# Altium schematic sheet stoplight_v1.0.SchDoc
size A4
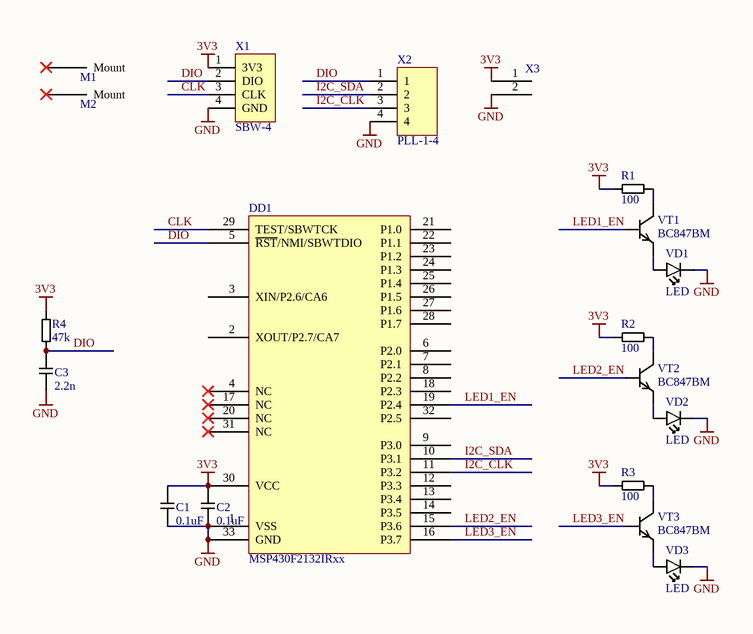
[diagram p0: stoplight_v1.0.SchDoc]

## Parts
C1  0.1uF  [C0603]
C2  0.1uF  [C0603]
C3  2.2n  [C0603]
DD1  MSP430F2132IRxx  [QFN-32 5x5 0.5]
M1  MountHoleEmpty  [MountHole 2mm Empty]  (value not drawn)
M2  MountHoleEmpty  [MountHole 2mm Empty]  (value not drawn)
R1  100  [R0603]
R2  100  [R0603]
R3  100  [R0603]
R4  47k  [R0603]
VD1  LED  [LED0603]
VD2  LED  [LED0603]
VD3  LED  [LED0603]
VT1  BC847BM  [SOT-883]
VT2  BC847BM  [SOT-883]
VT3  BC847BM  [SOT-883]
X1  SBW-4  [PLL-1-4]
X2  PLL-1-4  [PLL-1-4]
X3  POWER_PINS  [POWER_PINS]  (value not drawn)

## Nets
3V3: C1.1 C2.1 DD1.30(VCC) R1.1 R2.1 R3.1 R4.1 X1.1(3V3) X3.1(A)
GND: C1.2 C2.2 C3.2 DD1.1(VSS) DD1.33(GND) VD1.1 VD2.1 VD3.1 X1.4(GND) X2.4 X3.2(B)
CLK: DD1.29(TEST/SBWTCK) X1.3(CLK)
DIO: C3.1 DD1.5(~{RST}/NMI/SBWTDIO) R4.2 X1.2(DIO) X2.1
I2C_CLK: DD1.11(P3.2) X2.3
I2C_SDA: DD1.10(P3.1) X2.2
LED1_EN: DD1.19(P2.4) VT1.1(B)
LED2_EN: DD1.15(P3.6) VT2.1(B)
LED3_EN: DD1.16(P3.7) VT3.1(B)
NetR1_2: R1.2 VT1.3(C)
NetR2_2: R2.2 VT2.3(C)
NetR3_2: R3.2 VT3.3(C)
NetVD1_2: VD1.2 VT1.2(E)
NetVD2_2: VD2.2 VT2.2(E)
NetVD3_2: VD3.2 VT3.2(E)

Not connected (* = marked no-connect by the designer): DD1 2(XOUT/P2.7/CA7) 3(XIN/P2.6/CA6) 4(NC)* 6(P2.0) 7(P2.1) 8(P2.2) 9(P3.0) 12(P3.3) 13(P3.4) 14(P3.5) 17(NC)* 18(P2.3) 20(NC)* 21(P1.0) 22(P1.1) 23(P1.2) 24(P1.3) 25(P1.4) 26(P1.5) 27(P1.6) 28(P1.7) 31(NC)* 32(P2.5); M1 1(Mount)*; M2 1(Mount)*

## Library data of the parts
C1-C3 = C
DD1 = MSP430F2132IRxx: TI 16bit MCU MSP430 series
M1 M2 = MountHoleEmpty: Mounting hole without metallization
R1-R4 = R
VD1-VD3 = LED: SMD LED
VT1-VT3 = BC847BM: SOT-883 bipolar transistor hfe=290
X1 = SBW-4: TI MSP430 SpyByWire connector
X2 = PLL-1-4: 1.27mm pin header
X3 = POWER_PINS: On board power pins